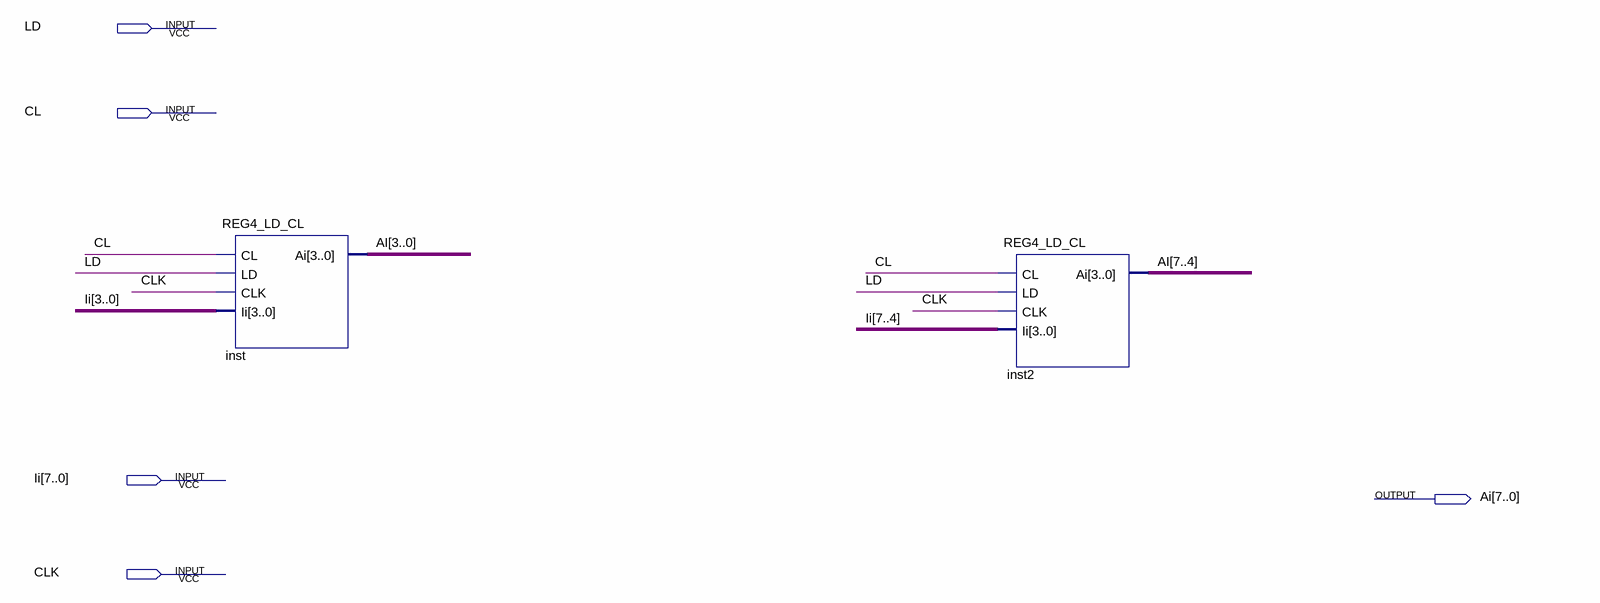
[diagram p0: schematic sheet]
// Quartus schematic REG8_LD_CL.bdf as structural Verilog: 2 symbols, 5 pins
module REG8_LD_CL (
  input  LD,
  input  CL,
  input  [7:0] Ii,
  input  CLK,
  output [7:0] Ai
);

  REG4_LD_CL inst (.CL(CL), .LD(LD), .CLK(CLK), .Ii(Ii[3:0]), .Ai(Ai[3:0]));
  REG4_LD_CL inst2 (.CL(CL), .LD(LD), .CLK(CLK), .Ii(Ii[7:4]), .Ai(Ai[7:4]));
endmodule
